# Altium project Current Loop.PrjPcb
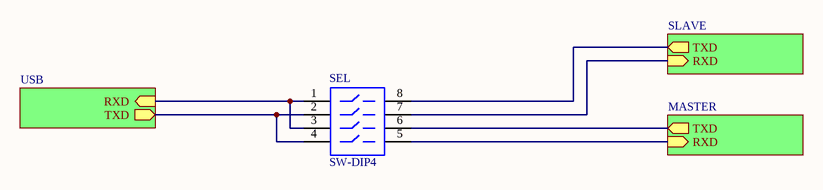
[diagram p0: Main.SchDoc]
4 sheets, 37 parts. Net scope: hierarchical (ports join the sheet entries above them; power ports are global).
Board file: MAIN.PcbDoc
Sheets:
  Main.SchDoc
    USB = ft232.SchDoc
    MASTER = MASTER.SchDoc
    SLAVE = SLAVE.SchDoc

## Sheet Main.SchDoc
size A; SheetNumber: 1; SheetTotal: 8

### Parts
SEL  SW-DIP4  [DIPSW-4-SMD]

### Sub-sheets
MASTER = MASTER.SchDoc: RXD (in), TXD (out)
SLAVE = SLAVE.SchDoc: RXD (in), TXD (out)
USB = ft232.SchDoc: RXD (in), TXD (out)

### Nets
NetIC1_6: SEL.5 ; sheet MASTER/RXD
NetIC2_7: SEL.6 ; sheet MASTER/TXD
NetIC3_6: SEL.7 ; sheet SLAVE/RXD
NetIC4_7: SEL.8 ; sheet SLAVE/TXD
NetSEL_1: SEL.1 SEL.3 ; sheet USB/RXD
NetSEL_2: SEL.2 SEL.4 ; sheet USB/TXD

### Library data of the parts
SEL = SW-DIP4: DIP Switch; Published: 24-Mar-1999; LatestRevisionDate: 17-Jul-2002; LatestRevisionNote: Re-released for DXP Platform.; PackageReference: DIP-8; Publisher: Altium Limited

## Sheet ft232.SchDoc
size A; SheetNumber: 2; SheetTotal: 7
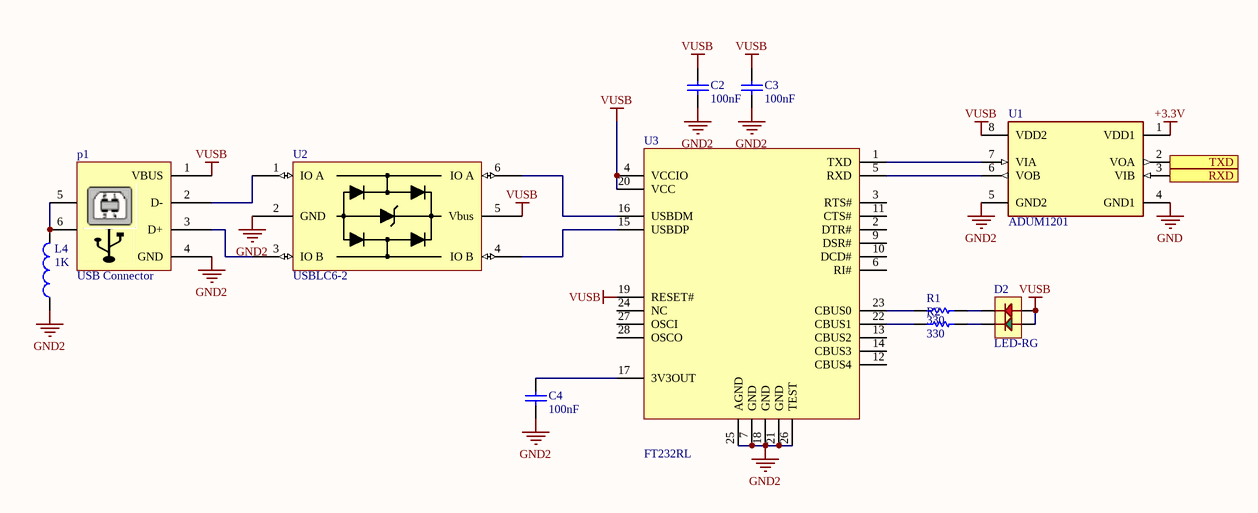
[diagram p1: ft232.SchDoc]

### Parts
C2  100nF  [C805]
C3  100nF  [C805]
C4  100nF  [C805]
D2  LED-RG  [LED-1210]
L4  1K  [r805]
p1  USB Connector  [USB2-B-R]
R1  330  [R0603]
R2  330  [R0603]
U1  ADUM1201  [soic-8n]
U2  USBLC6-2  [SOT-23-6]
U3  FT232RL  [SSOP-28N]

### Ports
RXD (in), TXD (out)

### Nets
+3.3V: U1.1(VDD1)
GND: U1.4(GND1)
GND2: C2.1 C3.1 C4.1 L4.1 p1.4(GND) U1.5(GND2) U2.2(GND) U3.7(GND) U3.18(GND) U3.21(GND) U3.25(AGND) U3.26(TEST)
VUSB: C2.2 C3.2 D2.1(GRN-A) D2.2(RED-A) p1.1(VBUS) U1.8(VDD2) U2.5(Vbus) U3.4(VCCIO) U3.19(RESET#) U3.20(VCC)
NetC4_2: C4.2 U3.17(3V3OUT)
NetD2_3: D2.3(RED-C) R1.2
NetD2_4: D2.4(GRN-C) R2.2
NetL4_2: L4.2 p1.5 p1.6
Netp1_2: p1.2(D-) U2.1(IO_A)
Netp1_3: p1.3(D+) U2.3(IO_B)
NetR1_1: R1.1 U3.23(CBUS0)
NetR2_1: R2.1 U3.22(CBUS1)
NetSEL_1: U1.3(VIB) ; port RXD
NetSEL_2: U1.2(VOA) ; port TXD
NetU1_6: U1.6(VOB) U3.5(RXD)
NetU1_7: U1.7(VIA) U3.1(TXD)
NetU2_4: U2.4(IO_B) U3.15(USBDP)
NetU2_6: U2.6(IO_A) U3.16(USBDM)

Not connected (* = marked no-connect by the designer): U3 2(DTR#) 3(RTS#) 6(RI#) 8(NC) 9(DSR#) 10(DCD#) 11(CTS#) 12(CBUS4) 13(CBUS2) 14(CBUS3) 24(NC) 27(OSCI) 28(OSCO)

### Library data of the parts
C2-C4 = Cap: Capacitor; Designer: Parsa Malekpour; Value: 100nF
D2 = LED-RG-4
L4 = Ferrite Bead: Code_IEC: 1005; Published: 8-Jun-2000; LatestRevisionDate: 29-May-2009; LatestRevisionNote: IPC-7351 Footprint Added.; Publisher: Altium Limited; PackageDescription: Chip Inductor; Code_JEITA: 0402; Value: 1K
p1 = USB2-B: USB Connector-B Type; Designer: Eng. Saeid Jorablo; Company: DASE Co; Adding Date: 10/26/2010
R1 R2 = Resistor: Designer: Parsa Malekpour; Value: 330
U1 = ADUM1201: Dual-Channel Digital Isolators; MF: {'manufacturer': u'Analog Devices'}; MP: ADUM1201AR; Package: None; Price: None; Value: *; Availability: Unavailable
U2 = USBLC6-2: Very low capacitance ESD protection

## Sheet MASTER.SchDoc
size A; SheetNumber: 5; SheetTotal: 9
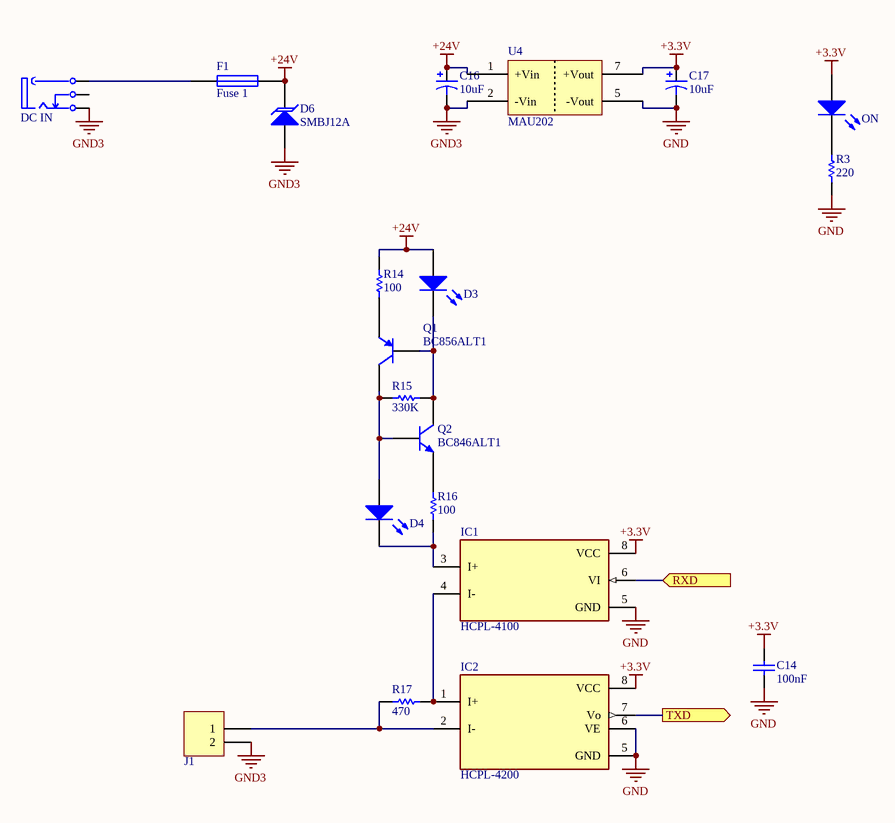
[diagram p2: MASTER.SchDoc]

### Parts
C14  100nF  [C603]
C16  10uF  [CAP-TAN-B]
C17  10uF  [CAP-TAN-B]
D3  LED  [LED-1206]  (value not drawn)
D4  LED  [LED-1206]  (value not drawn)
D6  SMBJ12A  [DO-214AA]
DC_IN  JACK  [jack-dc]  (value not drawn)
F1  Fuse 1  [PTC-0805]
IC1  HCPL-4100  [DIP-8]
IC2  HCPL-4200  [DIP-8]
J1  CONN-2  [XH-2]  (value not drawn)
ON  LED  [LED-1206]  (value not drawn)
Q1  BC856ALT1  [SOT-23]
Q2  BC846ALT1  [SOT-23]
R3  220  [R805]
R14  100  [R805]
R15  330K  [R805]
R16  100  [R805]
R17  470  [R805]
U4  MAU202  [MAU202]

### Ports
RXD (in), TXD (out)

### Nets
+3.3V: C14.2 C17.1 IC1.8(VCC) IC2.8(VCC) ON.1(A) U4.7(+Vout)
+24V: C16.1 D3.1(A) D6.2(K) F1.2 R14.2 U4.1(+Vin)
GND: C14.1 C17.2 IC1.5(GND) IC2.5(GND) IC2.6(VE) R3.1 U4.5(-Vout)
GND3: C16.2 D6.1(A) DC_IN.3(sleeve) J1.2 U4.2(-Vin)
NetD3_2: D3.2(K) Q1.1(B) Q2.3(C) R15.1
NetD4_1: D4.1(A) Q1.3(C) Q2.1(B) R15.2
NetD4_2: D4.2(K) IC1.3(I+) R16.1
NetDC_IN_2: DC_IN.2(tip) F1.1
NetIC1_4: IC1.4(I-) IC2.1(I+) R17.2
NetIC1_6: IC1.6(VI) ; port RXD
NetIC2_2: IC2.2(I-) J1.1 R17.1
NetIC2_7: IC2.7(Vo) ; port TXD
NetON_2: ON.2(K) R3.2
NetQ1_2: Q1.2(E) R14.1
NetQ2_2: Q2.2(E) R16.2

Not connected (* = marked no-connect by the designer): DC_IN 1(det)

### Library data of the parts
C14 = Cap: Capacitor; Designer: Parsa Malekpour; Value: 100nF
C16 C17 = CAP-POL: Polar Capacitor; Voltage: 10V; Value: 10uF
D6 = SMBJxxA: Surface Mount Transient Voltage Suppressors Diode; Parameter 1: *
DC_IN = JACK-DC
F1 = Fuse 1: Fuse; Published: 8-Jun-2000; LatestRevisionDate: 17-Jul-2002; LatestRevisionNote: Re-released for DXP Platform.; PackageReference: PIN-W2/E2.8; Publisher: Altium Limited; PackageDescription: Thru-Hole; 2 Leads
IC1 = HCPL-4100: <b>Isolation Amplifer</b><p> Source: http://www.avagotech.com/docs/AV02-0410EN; MF: {'manufacturer': u'Broadcom Limited'}; Package: None; Value: *; Price: None; MP: HCPL-4100; Availability: Unavailable
IC2 = HCPL-4200: Optically Coupled 20 mA Current Loop Receiver; MF: {'manufacturer': u'Broadcom Limited'}; Package: None; Value: *; Price: None; MP: HCPL-4100; Availability: Unavailable
Q1 = BC856ALT1: General Purpose Transistor PNP Silicon; Published: 29-Sep-2000; LatestRevisionDate: 17-Jul-2002; LatestRevisionNote: Re-released for DXP Platform.; DatasheetVersion: 1997; PackageVersion: 1997; PackageReference: 318-08; Publisher: Altium Limited; PackageDescription: SOT-23; 3 Leads; Body 3.0 x 2.6 mm, inc. leads (LxW max); ComponentLink1Description: Manufacturer Link; ComponentLink1URL: http://www.onsemi.com/site/products/landing?taxonomyID=194; ComponentLink2Description: Datasheet; ComponentLink2URL: http://www.onsemi.com/pub/Collateral/BC856ALT1-D.PDF
Q2 = BC846ALT1: General Purpose Transistor NPN Silicon; Published: 29-Sep-2000; LatestRevisionDate: 17-Jul-2002; LatestRevisionNote: Re-released for DXP Platform.; DatasheetVersion: 1997; PackageVersion: 1997; PackageReference: 318-08; Publisher: Altium Limited; PackageDescription: SOT-23; 3 Leads; Body 3.0 x 2.6 mm, inc. leads (LxW max); ComponentLink1Description: Manufacturer Link; ComponentLink1URL: http://www.onsemi.com/site/products/landing?taxonomyID=194; ComponentLink2Description: Datasheet; ComponentLink2URL: http://www.onsemi.com/pub/Collateral/BC846ALT1-D.PDF
R3 R14-R17 = Resistor: Designer: Parsa Malekpour
  R3: Value: 220
  R14 R16: Value: 100
  R15: Value: 330K
  R17: Value: 470
U4 = MAU202: 1W, FIXED INPUT ISOLATED & UNREGULATED / SINGLE OUTPUT DC-DC CONVERTER

## Sheet SLAVE.SchDoc
size A; SheetNumber: 6; SheetTotal: 7
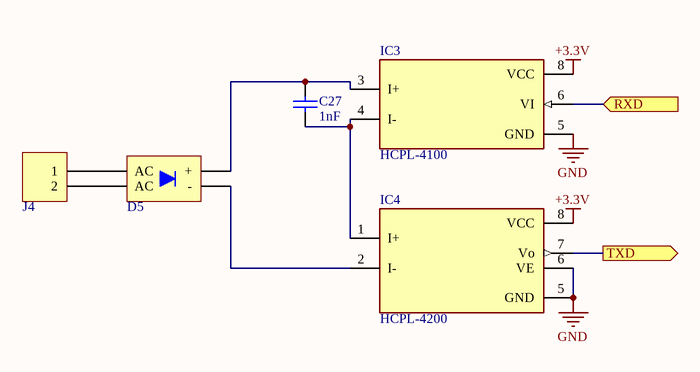
[diagram p3: SLAVE.SchDoc]

### Parts
C27  1nF  [C1206]
D5  HD08  [MINIDIP]  (value not drawn)
IC3  HCPL-4100  [DIP-8]
IC4  HCPL-4200  [DIP-8]
J4  CONN-2  [XH-2]  (value not drawn)

### Ports
RXD (in), TXD (out)

### Nets
+3.3V: IC3.8(VCC) IC4.8(VCC)
GND: IC3.5(GND) IC4.5(GND) IC4.6(VE)
NetC27_1: C27.1 IC3.4(I-) IC4.1(I+)
NetC27_2: C27.2 D5.1(+) IC3.3(I+)
NetD5_2: D5.2(-) IC4.2(I-)
NetD5_3: D5.3(AC) J4.2
NetD5_4: D5.4(AC) J4.1
NetIC3_6: IC3.6(VI) ; port RXD
NetIC4_7: IC4.7(Vo) ; port TXD

### Library data of the parts
C27 = Cap: Capacitor; Designer: Parsa Malekpour; Value: 1nF
IC3 = HCPL-4100: as IC1 on sheet MASTER; Package: None; Value: *; Price: None; MP: HCPL-4100; Availability: Unavailable
IC4 = HCPL-4200: as IC2 on sheet MASTER; Package: None; Value: *; Price: None; MP: HCPL-4100; Availability: Unavailable

## Nets that join several sheets
+3.3V: ft232 (U1.1), MASTER (6 pins), SLAVE (IC3.8 IC4.8)
GND: ft232 (U1.4), MASTER (7 pins), SLAVE (IC3.5 IC4.5 IC4.6)
NetIC1_6: Main (SEL.5), MASTER (IC1.6)
NetIC2_7: Main (SEL.6), MASTER (IC2.7)
NetIC3_6: Main (SEL.7), SLAVE (IC3.6)
NetIC4_7: Main (SEL.8), SLAVE (IC4.7)
NetSEL_1: Main (SEL.1 SEL.3), ft232 (U1.3)
NetSEL_2: Main (SEL.2 SEL.4), ft232 (U1.2)